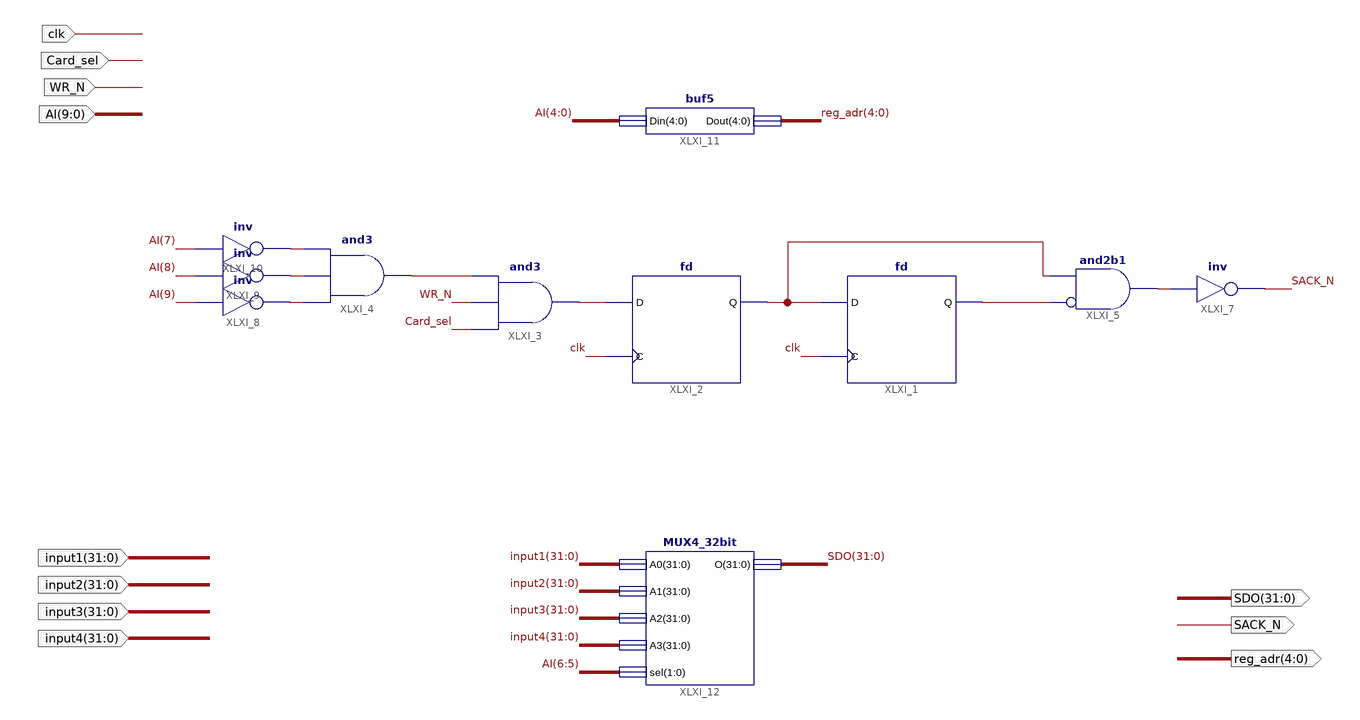
[diagram p0: schematic sheet 1]
// Xilinx ISE schematic myslv_monitor.sch (spartan2) as structural Verilog: 11 symbols, 11 ports
module myslv_monitor (
  input  clk,
  input  Card_sel,
  input  WR_N,
  input  [31:0] input2,
  input  [31:0] input3,
  input  [31:0] input4,
  input  [31:0] input1,
  input  [9:0] AI,
  output [31:0] SDO,
  output SACK_N,
  output [4:0] reg_adr
);

  wire XLXN_1, XLXN_2, XLXN_3, XLXN_4, XLXN_54, XLXN_61, XLXN_62, XLXN_68;

  MUX4_32bit XLXI_12 (.A0(input1), .A1(input2), .A2(input3), .A3(input4), .sel(AI[6:5]), .O(SDO));
  buf5 XLXI_11 (.Din(AI[4:0]), .Dout(reg_adr));
  fd XLXI_2 (.C(clk), .D(XLXN_62), .Q(XLXN_61));
  fd XLXI_1 (.C(clk), .D(XLXN_61), .Q(XLXN_68));
  and XLXI_5 (XLXN_1, ~XLXN_68, XLXN_61);  // and2b1
  not XLXI_7 (SACK_N, XLXN_1);
  and XLXI_4 (XLXN_54, XLXN_2, XLXN_3, XLXN_4);
  not XLXI_8 (XLXN_2, AI[9]);
  not XLXI_9 (XLXN_3, AI[8]);
  not XLXI_10 (XLXN_4, AI[7]);
  and XLXI_3 (XLXN_62, Card_sel, WR_N, XLXN_54);
endmodule
